# EAGLE schematic main-board (EAGLE 7.5.0)

## Sheet 1 of 2: Power Supply
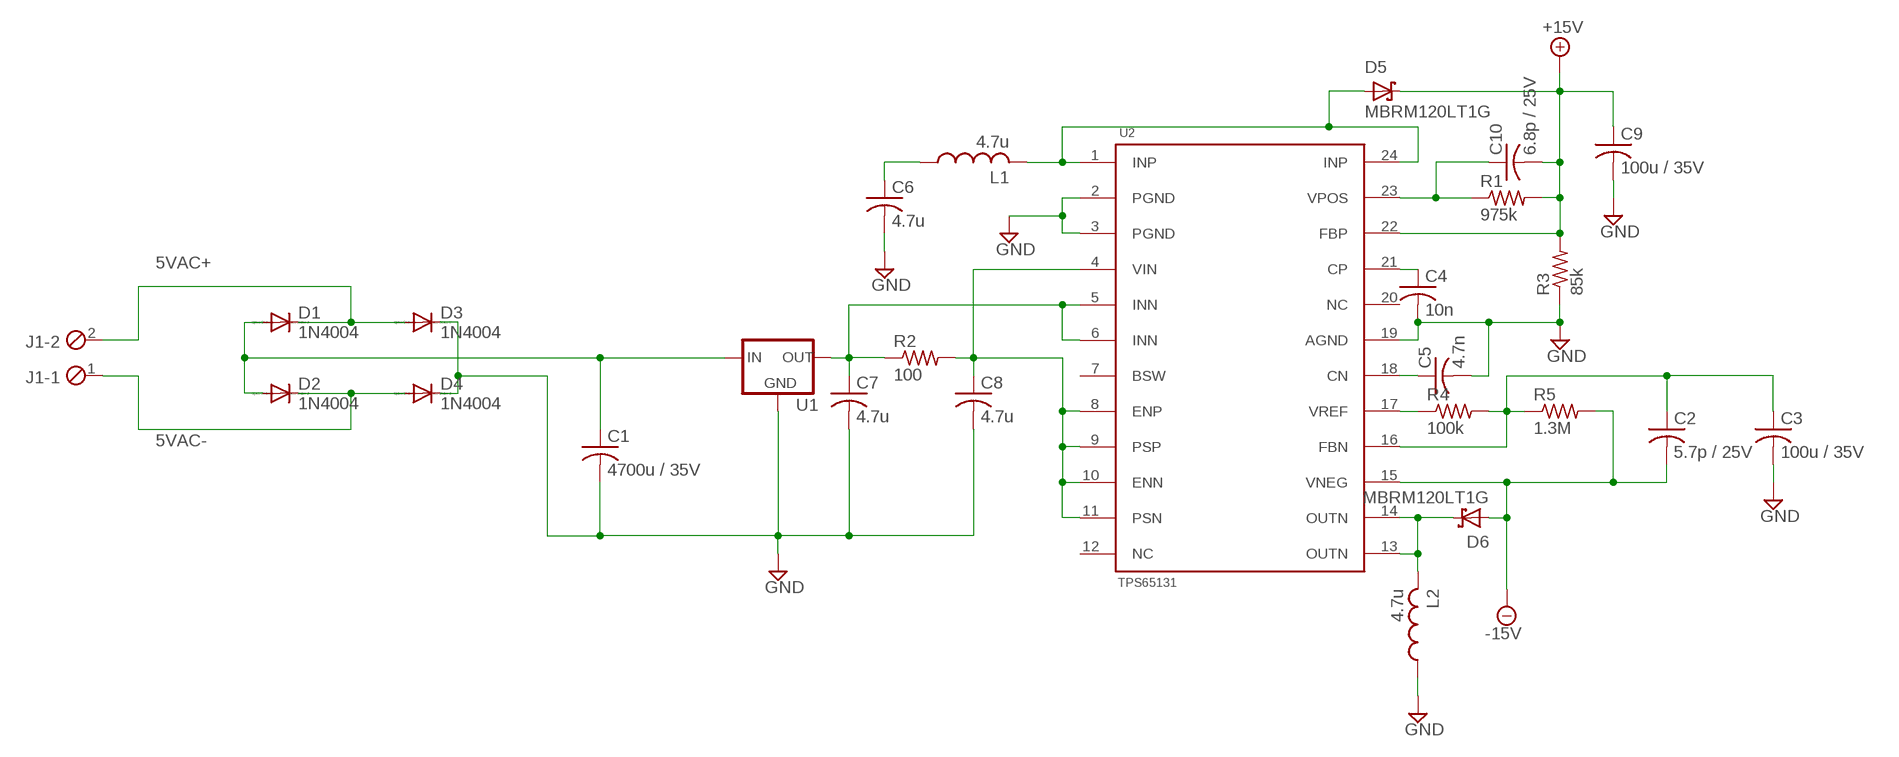
[diagram p0: schematic, sheet 1]

### Parts
C1  4700u / 35V  C-US050-035X075  [C050-035X075]
C2  5.7p / 25V  C-USC0805  [C0805]
C3  100u / 35V  C-USC0805  [C0805]
C4  10n  C-USC0805  [C0805]
C5  4.7n  C-USC0805  [C0805]
C6  4.7u  C-USC0805  [C0805]
C7  4.7u  C-USC0805  [C0805]
C8  4.7u  C-USC0805  [C0805]
C9  100u / 35V  C-USC0805  [C0805]
C10  6.8p / 25V  C-USC0805  [C0805]
D1  1N4004  [DO41-10]
D2  1N4004  [DO41-10]
D3  1N4004  [DO41-10]
D4  1N4004  [DO41-10]
D5  MBRM120LT1G  [DO-216AA]
D6  MBRM120LT1G  [DO-216AA]
J1  MPT2  [2POL254]
L1  4.7u  L-US0207/2V  [0207/2V]
L2  4.7u  L-US0207/2V  [0207/2V]
R1  975k  R-US_R0805  [R0805]
R2  100  R-US_R0805  [R0805]
R3  85k  R-US_R0805  [R0805]
R4  100k  R-US_R0805  [R0805]
R5  1.3M  R-US_R0805  [R0805]
U1  78XXS  [78XXS]
U2  TPS65131  [VQFN-24]

### Nets
5VAC+: D1.C D3.A
5VAC-: D2.C D4.A
+15V: C9.1 C10.2 D5.1(C) R1.2 R3.2 U2.22(FBP) ; also sheet 2
-15V: C2.2 D6.2(A) R5.2 U2.15(VNEG) ; also sheet 2
GND: C1.2 C3.2 C4.2 C5.2 C6.2 C7.2 C8.2 C9.2 D3.C D4.C L2.1 R3.1 U1.GND U2.2(PGND) U2.3(PGND) U2.19(AGND) ; also sheet 2
N$1: C1.1 D1.A D2.A U1.IN
N$2: C7.1 R2.1 U1.OUT U2.5(INN) U2.6(INN)
N$3: C10.1 R1.1 U2.23(VPOS)
N$4: D5.2(A) L1.2 U2.1(INP) U2.24(INP)
N$5: C4.1 U2.21(CP)
N$6: C5.1 U2.18(CN)
N$7: R4.1 U2.17(VREF)
N$8: C2.1 C3.1 R4.2 R5.1 U2.16(FBN)
N$9: C8.1 R2.2 U2.4(VIN) U2.8(ENP) U2.9(PSP) U2.10(ENN) U2.11(PSN)
N$10: C6.1 L1.1
N$11: D6.1(C) L2.2 U2.13(OUTN) U2.14(OUTN)
Unconnected: J1.1 J1.2 U2.7(BSW) U2.12(NC) U2.20(NC)

## Sheet 2 of 2
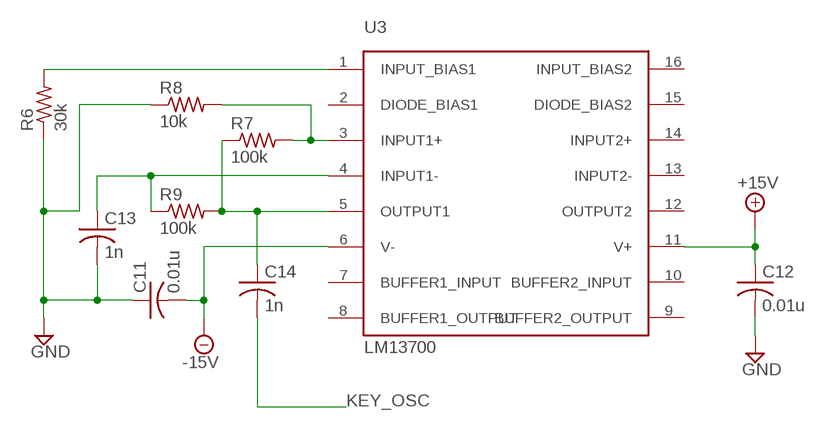
[diagram p1: schematic, sheet 2]

### Parts
C11  0.01u  C-USC0805  [C0805]
C12  0.01u  C-USC0805  [C0805]
C13  1n  C-USC0805  [C0805]
C14  1n  C-USC0805  [C0805]
R6  30k  R-US_R0805  [R0805]
R7  100k  R-US_R0805  [R0805]
R8  10k  R-US_R0805  [R0805]
R9  100k  R-US_R0805  [R0805]
U3  LM13700  [SOIC-16]

### Nets
+15V: C12.1 U3.11(V+) ; also sheet 1
-15V: C11.2 U3.6(V-) ; also sheet 1
GND: C11.1 C12.2 C13.2 R6.1 R8.1 ; also sheet 1
KEY_OSC: C14.2
N$12: R6.2 U3.1(INPUT_BIAS1)
N$13: C13.1 R9.1 U3.4(INPUT1-)
N$15: R7.2 R8.2 U3.3(INPUT1+)
N$16: C14.1 R7.1 R9.2 U3.5(OUTPUT1)
Unconnected: U3.2(DIODE_BIAS1) U3.7(BUFFER1_INPUT) U3.8(BUFFER1_OUTPUT) U3.9(BUFFER2_OUTPUT) U3.10(BUFFER2_INPUT) U3.12(OUTPUT2) U3.13(INPUT2-) U3.14(INPUT2+) U3.15(DIODE_BIAS2) U3.16(INPUT_BIAS2)

## Library data of the parts
C1 = rcl:C-US: CAPACITOR, American symbol; OC_NEWARK: unknown
C2-C14 = rcl:C-US: CAPACITOR, American symbol
D1-D4 = diode:1N4004: DIODE general purpose rectifier, 1 A; MF: TEXAS INSTRUMENTS; MPN: TPS65131RGET; OC_NEWARK: 44J2536
D5 D6 = custom-diodes:MBRM120LT1G: MBRM120LT1G - http://www.onsemi.com/pub_link/Collateral/MBRM120L-D.PDF
J1 = con-phoenix-254:MPT2: PHOENIX CONNECTOR; OC_FARNELL: unknown; OC_NEWARK: unknown
L1 L2 = rcl:L-US: INDUCTOR, American symbol
R1-R9 = rcl:R-US_: RESISTOR, American symbol
U1 = v-reg:78XXS: VOLTAGE REGULATOR; OC_NEWARK: unknown
U2 = texas-instruments:TPS65131
U3 = texas-instruments:LM13700: LM13700 - 2MHz Operational Transconductance Amplifier http://www.ti.com/lit/ds/symlink/lm13700.pdf